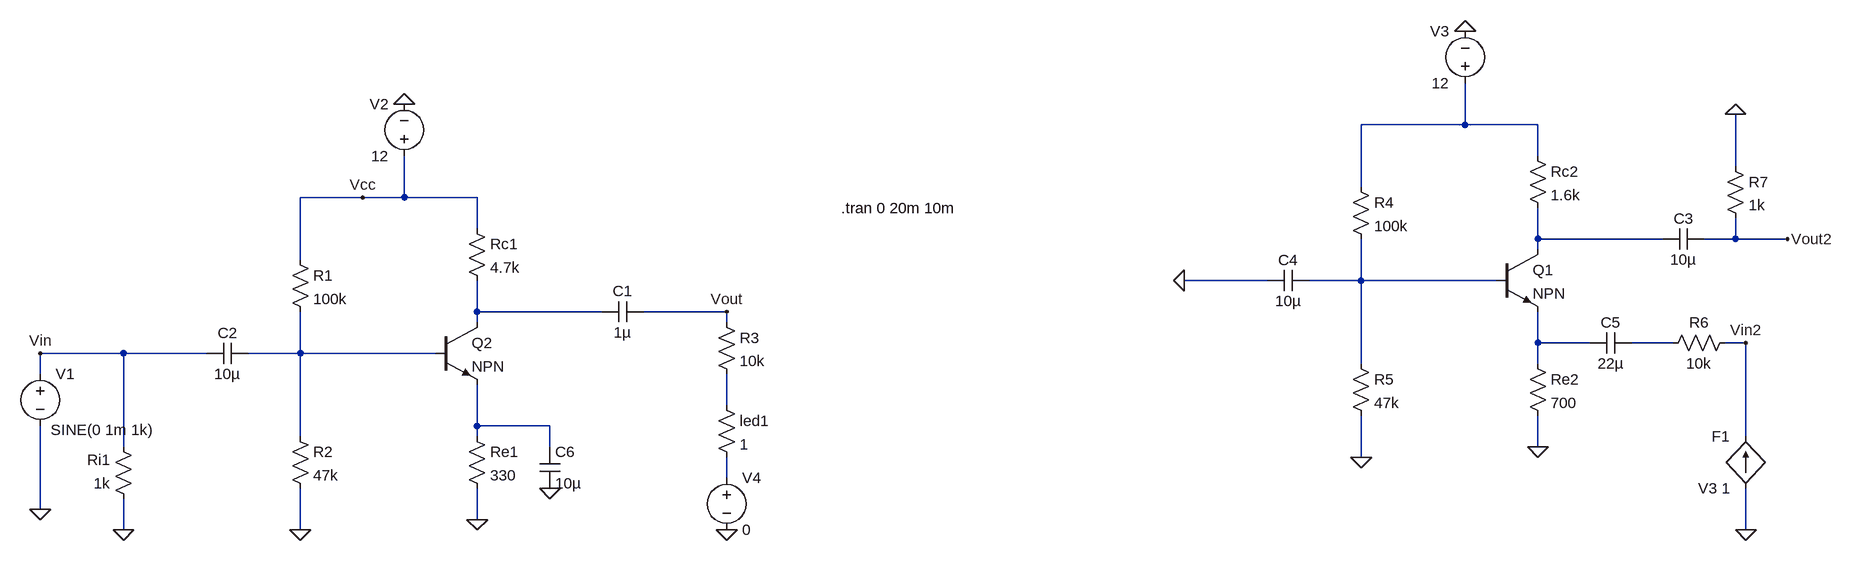
[diagram p0: schematic Draft63.asc]
Draft63.asc, the LTspice schematic file:
Version 4
SHEET 1 1796 680
WIRE 1216 -96 1216 -160
WIRE 1216 -96 1056 -96
WIRE 1328 -96 1216 -96
WIRE 1328 -48 1328 -96
WIRE 1632 -32 1632 -112
WIRE 1056 0 1056 -96
WIRE -480 16 -576 16
WIRE -416 16 -416 -48
WIRE -416 16 -480 16
WIRE -304 16 -416 16
WIRE -304 64 -304 16
WIRE 1328 80 1328 32
WIRE 1520 80 1328 80
WIRE 1632 80 1632 48
WIRE 1632 80 1584 80
WIRE 1712 80 1632 80
WIRE 1328 96 1328 80
WIRE -576 112 -576 16
WIRE 912 144 784 144
WIRE 1056 144 1056 80
WIRE 1056 144 976 144
WIRE 1264 144 1056 144
WIRE -304 192 -304 144
WIRE -112 192 -304 192
WIRE 80 192 -48 192
WIRE -304 208 -304 192
WIRE 80 208 80 192
WIRE 1328 240 1328 192
WIRE 1408 240 1328 240
WIRE 1536 240 1472 240
WIRE 1648 240 1616 240
WIRE -848 256 -976 256
WIRE -720 256 -848 256
WIRE -576 256 -576 192
WIRE -576 256 -656 256
WIRE -368 256 -576 256
WIRE 1056 272 1056 144
WIRE 1328 272 1328 240
WIRE -976 288 -976 256
WIRE 80 336 80 288
WIRE -304 368 -304 304
WIRE -192 368 -304 368
WIRE -576 384 -576 256
WIRE -304 384 -304 368
WIRE 1648 384 1648 240
WIRE -848 400 -848 256
WIRE -192 400 -192 368
WIRE 1328 400 1328 352
WIRE 1056 416 1056 352
WIRE 80 448 80 416
WIRE -976 496 -976 368
WIRE -304 512 -304 464
WIRE -848 528 -848 480
WIRE -576 528 -576 464
WIRE 1648 528 1648 464
FLAG -976 496 0
FLAG -576 528 0
FLAG -976 256 Vin
FLAG -480 16 Vcc
FLAG 80 192 Vout
FLAG -416 -128 0
FLAG -848 528 0
FLAG 1056 416 0
FLAG 1216 -240 0
FLAG 784 144 0
FLAG 1648 528 0
FLAG 1328 400 0
FLAG 1632 -112 0
FLAG 1712 80 Vout2
FLAG 80 528 0
FLAG 1648 240 Vin2
FLAG -192 464 0
FLAG -304 512 0
SYMBOL res -592 96 R0
SYMATTR InstName R1
SYMATTR Value 100k
SYMBOL res -320 48 R0
SYMATTR InstName Rc1
SYMATTR Value 4.7k
SYMBOL res -592 368 R0
SYMATTR InstName R2
SYMATTR Value 47k
SYMBOL res -320 368 R0
SYMATTR InstName Re1
SYMATTR Value 330
SYMBOL cap -48 176 R90
WINDOW 0 0 32 VBottom 2
WINDOW 3 32 32 VTop 2
SYMATTR InstName C1
SYMATTR Value 1µ
SYMBOL res -832 496 R180
WINDOW 0 36 76 Left 2
WINDOW 3 36 40 Left 2
SYMATTR InstName Ri1
SYMATTR Value 1k
SYMBOL cap -656 240 R90
WINDOW 0 0 32 VBottom 2
WINDOW 3 32 32 VTop 2
SYMATTR InstName C2
SYMATTR Value 10µ
SYMBOL voltage -976 272 R0
WINDOW 123 24 124 Left 2
WINDOW 39 0 0 Left 0
WINDOW 3 16 102 Left 2
SYMATTR Value SINE(0 1m 1k)
SYMATTR InstName V1
SYMBOL voltage -416 -32 R180
WINDOW 0 24 96 Left 2
WINDOW 3 24 16 Left 2
WINDOW 123 0 0 Left 0
WINDOW 39 0 0 Left 0
SYMATTR InstName V2
SYMATTR Value 12
SYMBOL res 64 192 R0
SYMATTR InstName R3
SYMATTR Value 10k
SYMBOL res 64 320 R0
SYMATTR InstName led1
SYMATTR Value 1
SYMBOL res 1040 -16 R0
SYMATTR InstName R4
SYMATTR Value 100k
SYMBOL res 1312 -64 R0
SYMATTR InstName Rc2
SYMATTR Value 1.6k
SYMBOL res 1040 256 R0
SYMATTR InstName R5
SYMATTR Value 47k
SYMBOL res 1312 256 R0
SYMATTR InstName Re2
SYMATTR Value 700
SYMBOL cap 1584 64 R90
WINDOW 0 0 32 VBottom 2
WINDOW 3 32 32 VTop 2
SYMATTR InstName C3
SYMATTR Value 10µ
SYMBOL cap 976 128 R90
WINDOW 0 0 32 VBottom 2
WINDOW 3 32 32 VTop 2
SYMATTR InstName C4
SYMATTR Value 10µ
SYMBOL voltage 1216 -144 R180
WINDOW 0 24 96 Left 2
WINDOW 3 24 16 Left 2
WINDOW 123 0 0 Left 0
WINDOW 39 0 0 Left 0
SYMATTR InstName V3
SYMATTR Value 12
SYMBOL cap 1472 224 R90
WINDOW 0 0 32 VBottom 2
WINDOW 3 32 32 VTop 2
SYMATTR InstName C5
SYMATTR Value 22µ
SYMBOL res 1632 224 R90
WINDOW 0 0 56 VBottom 2
WINDOW 3 32 56 VTop 2
SYMATTR InstName R6
SYMATTR Value 10k
SYMBOL res 1616 -48 R0
SYMATTR InstName R7
SYMATTR Value 1k
SYMBOL f 1648 464 R180
WINDOW 0 24 80 Left 2
WINDOW 3 24 0 Left 2
SYMATTR InstName F1
SYMATTR Value V3 1
SYMBOL voltage 80 432 R0
WINDOW 123 0 0 Left 0
WINDOW 39 0 0 Left 0
SYMATTR InstName V4
SYMATTR Value 0
SYMBOL npn 1264 96 R0
SYMATTR InstName Q1
SYMBOL npn -368 208 R0
SYMATTR InstName Q2
SYMBOL cap -208 400 R0
SYMATTR InstName C6
SYMATTR Value 10µ
TEXT 256 32 Left 2 !.tran 0 20m 10m

The netlist it stands for:
* Draft63.asc
R1 Vcc N007 100k
Rc1 Vcc N004 4.7k
R2 N007 0 47k
Re1 N009 0 330
C1 Vout N004 1µ
Ri1 0 Vin 1k
C2 N007 Vin 10µ
V1 Vin 0 SINE(0 1m 1k)
V2 Vcc 0 12
R3 Vout N008 10k
R§led1 N008 N010 1
R4 N001 N003 100k
Rc2 N001 N002 1.6k
R5 N003 0 47k
Re2 N005 0 700
C3 Vout2 N002 10µ
C4 N003 0 10µ
V3 N001 0 12
C5 N006 N005 22µ
R6 Vin2 N006 10k
R7 0 Vout2 1k
F1 0 Vin2 V3 1
V4 N010 0 0
Q1 N002 N003 N005 0 NPN
Q2 N004 N007 N009 0 NPN
C6 N009 0 10µ
.model NPN NPN
.model PNP PNP
.lib standard.bjt
.tran 0 20m 10m
.backanno
.end